# Altium schematic sheet ESP32.SchDoc
size A3; SheetNumber: 3; SheetTotal: 16
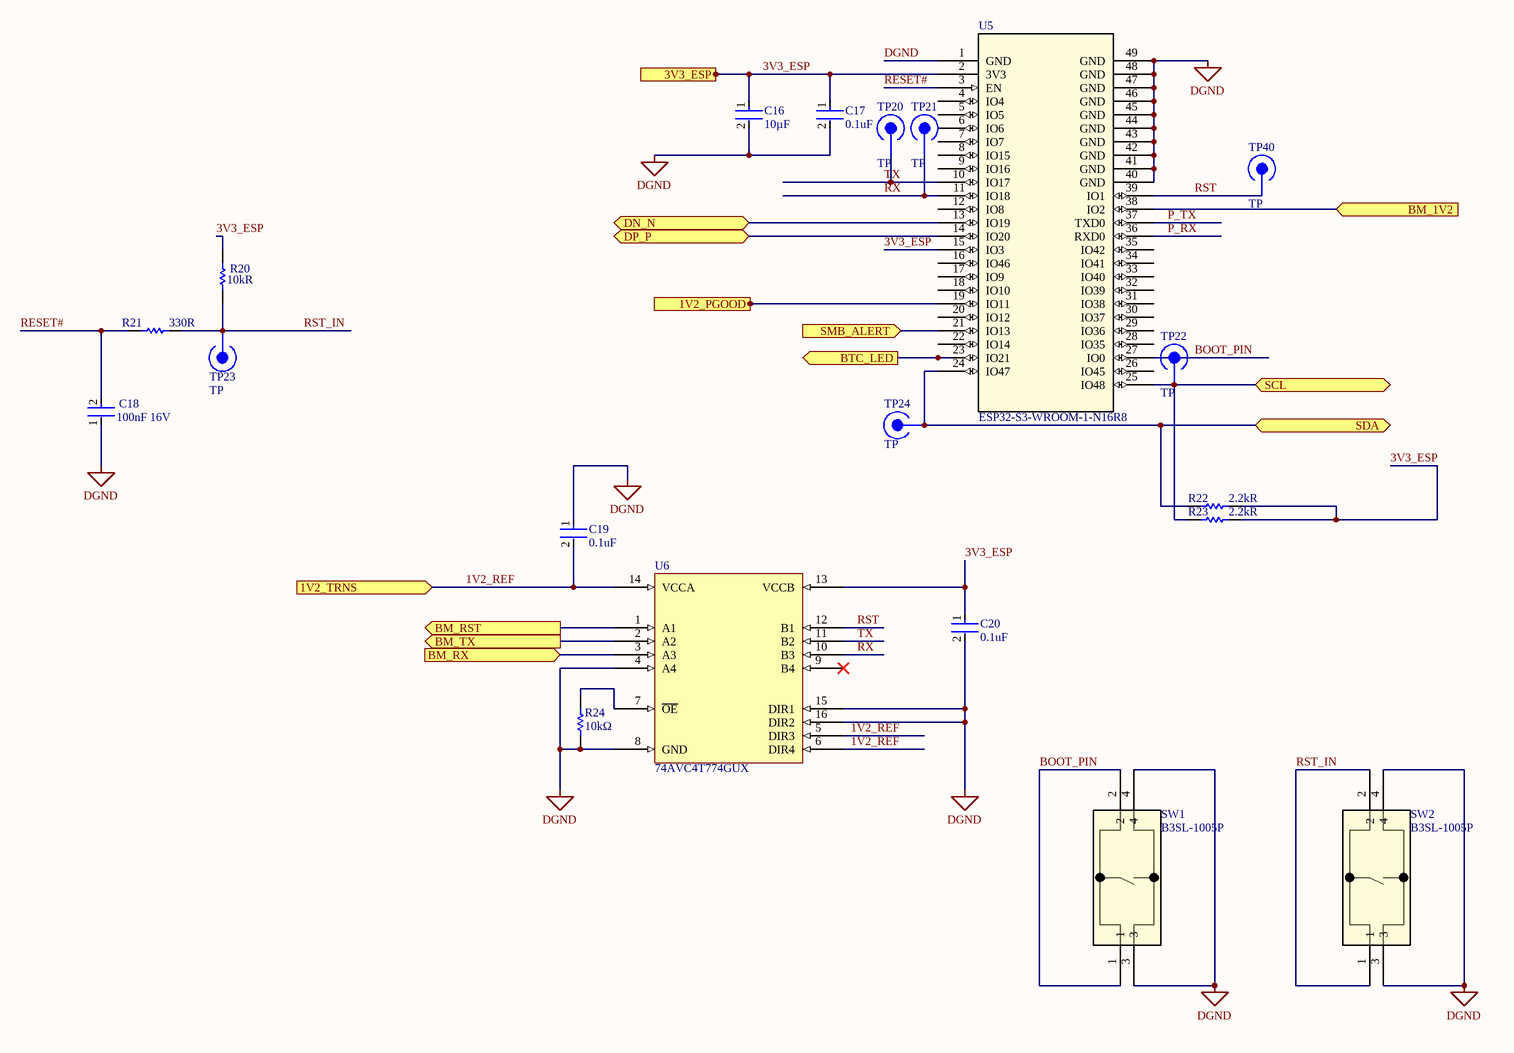
[diagram p0: ESP32.SchDoc]

## Parts
C16  value 10µF  [FP-GRM21B-0_15-MFG]  (hidden comment: GRM21BR61E106KA73L)
C17  value 0.1uF  [FP-CC0402-IPC_C]  (hidden comment: CC0402KRX7R7BB104)
C18  value 100nF  Rating: 16V  [FP-GRM15-MFG]  (hidden comment: GRM155R71C104KA88D)
C19  value 0.1uF  [FP-CC0402-IPC_C]  (hidden comment: CC0402KRX7R7BB104)
C20  value 0.1uF  [FP-CC0402-IPC_C]  (hidden comment: CC0402KRX7R7BB104)
R20  value 10kR  [RESC1005X40X25LL10T10]  (hidden comment: RK73H1ETTP1002F)
R21  value 330R  [RESC1005X40X25ML10T10]  (hidden comment: RK73H1ETTP3300F)
R22  value 2.2kR  [RESC1005X40X25NL10T10]  (hidden comment: RK73H1ETTP2201F)
R23  value 2.2kR  [RESC1005X40X25NL10T10]  (hidden comment: RK73H1ETTP2201F)
R24  value 10kΩ  [RESC1005X40X25LL10T10]  (hidden comment: RK73B1ETTP103J)
SW1  B3SL-1005P  [SW_B3SL-1002P_OMR]
SW2  B3SL-1005P  [SW_B3SL-1002P_OMR]
TP20  TP  [TP-Footprint-1]
TP21  TP  [TP-Footprint-1]
TP22  TP  [TP-Footprint-1]
TP23  TP  [TP-Footprint-1]
TP24  TP  [TP-Footprint-1]
TP40  TP  [TP-Footprint-1]
U5  ESP32-S3-WROOM-1-N16R8  [ESP32-S3-WROOM-1-N16R8-Footprint-1]
U6  74AVC4T774GUX  [74AVC4T774GUX-Footprint-1]

## Ports
1V2_PGOOD (in), 1V2_TRNS (in), 3V3_ESP (in), BM_1V2 (in), BM_RST (out), BM_RX (in), BM_TX (out), BTC_LED (out), DN_N (bidir), DP_P (bidir), SCL (bidir), SDA (bidir), SMB_ALERT (in)

## Nets
DGND: C16.2 C17.2 C18.1 C19.1 C20.2 R24.2 SW1.3 SW1.4 SW2.3 SW2.4 U5.1(GND) U5.40(GND) U5.41(GND) U5.42(GND) U5.43(GND) U5.44(GND) U5.45(GND) U5.46(GND) U5.47(GND) U5.48(GND) U5.49(GND) U6.4(A4) U6.8(GND) U6.15(DIR1) U6.16(DIR2)
1V2_PGOOD: U5.19(IO11) ; port 1V2_PGOOD
1V2_REF: C19.2 U6.5(DIR3) U6.6(DIR4) U6.14(VCCA) ; port 1V2_TRNS
3V3_ESP: C16.1 C17.1 C20.1 R20.2 R22.2 R23.2 U5.2(3V3) U5.15(IO3) U6.13(VCCB) ; port 3V3_ESP
BM_1V2: U5.38(IO2) ; port BM_1V2
BM_RST: U6.1(A1) ; port BM_RST
BM_RX: U6.3(A3) ; port BM_RX
BM_TX: U6.2(A2) ; port BM_TX
BOOT_PIN: SW1.1 SW1.2 U5.27(IO0)
BTC_LED: U5.23(IO21) ; port BTC_LED
DN_N: U5.13(IO19) ; port DN_N
DP_P: U5.14(IO20) ; port DP_P
P_RX: U5.36(RXD0)
P_TX: U5.37(TXD0)
RESET#: C18.2 R21.1 U5.3(EN)
RST: TP40.1 U5.39(IO1) U6.12(B1)
RST_IN: R20.1 R21.2 SW2.1 SW2.2 TP23.1
RX: TP21.1 U5.11(IO18) U6.10(B3)
SCL: R23.1 TP22.1 U5.25(IO48) ; port SCL
SDA: R22.1 TP24.1 U5.24(IO47) ; port SDA
SMB_ALERT: U5.21(IO13) ; port SMB_ALERT
TX: TP20.1 U5.10(IO17) U6.11(B2)
NetR24_1: R24.1 U6.7(~{OE})

Not connected (* = marked no-connect by the designer): U5 4(IO4) 5(IO5) 6(IO6) 7(IO7) 8(IO15) 9(IO16) 12(IO8) 16(IO46) 17(IO9) 18(IO10) 20(IO12) 22(IO14) 26(IO45) 28(IO35) 29(IO36) 30(IO37) 31(IO38) 32(IO39) 33(IO40) 34(IO41) 35(IO42); U6 9(B4)*

## Library data of the parts
C16 = CMP-001-00145-3: Ceramic Capacitor, Multilayer, Ceramic, 25V, 10% +Tol, 10% -Tol, X5R, 15% TC, 10uF, Surface Mount, 0805; Manufacturer: Murata; Reel Size: 8mm; Vendor: TTI; Template: MR_0805; Category: Capacitor; Price: 0.067; MOQ: 3000; Rating: 25V; Mounting: SMT; Package: 0805
C17 C19 C20 = CMP-001-00094-1: Multilayer Ceramic Capacitor, 0.1 uF, 25 V, ± 10%, X7R, 0402 [1005 Metric]; Rating: 16V; Reel Size: 8mm; Vendor: TTI; Category: Capacitor; Price: 0.004; Package: 0402; MOQ: 10000
C18 = CMP-001-00203-2: Ceramic Capacitor, Multilayer, Ceramic, 16V, 10% +Tol, 10% -Tol, X7R, 15% TC, 0.1uF, Surface Mount, 0402; Manufacturer: Murata; Reel Size: 8mm; Vendor: TTI; Template: MR_0402; Price Floor: 0.00317; MOQ: 10000; Price Floor Quantity: 750000; Category: Capacitor; Price @ MOQ: 0.003; Mounting: SMT; Case/Package: 0402; Design Item ID: CMP-00123-1; Source: Components - 07.02.25 - 13.24.SchLib
R20 = CMP-x00150-1: Fixed Resistor, Metal Glaze/thick Film, 0.1W, 10000ohm, 75V, 1% +/-Tol, 100ppm/Cel, Surface Mount, 0402
R21 = CMP-2002-04371-1: Manufacturer: KOA Speer; Part Number: RK73H1ETTP3300F
R22 R23 = CMP-2002-03812-1: Manufacturer: KOA Speer; Part Number: RK73H1ETTP2201F
R24 = CMP-009-00227-1: Fixed Resistor, Metal Glaze/thick Film, 0.1W, 10000ohm, 75V, 5% +/-Tol, 200ppm/Cel, Surface Mount, 0402; Rating: 1/10W; Vendor: TTI; Package: 0402; Price: 0.0017; Category: Resistor
SW1 SW2 = CMP-011-00029-1: No Description Available; Mfr_Name: Omron; Pins: 4; Design Item ID: B3SL-1005P; Component Type: Standard; Type: Type; RefDes: RefDes; Source: B3SL-1005P.SchLib
TP20-TP24 TP40 = CMP-001-0086-3: digital shovel test point
U5 = CMP-226-000000-01-A-2: No Description Available; Mfr_Name: Espressif Systems; Type: Type; Component Type: Standard; Design Item ID: ESP32-S3-WROOM-1-N16R8; Pin Count: 49; RefDes: RefDes; Source: ESP32-S3-WROOM-1-N16R8.SchLib
U6 = CMP-x00133-2: 74AVC4T774 - 4-bit dual supply translating transceiver; 3-state; Manufacturer: Nexperia; Template: NX_XQFN_16; Reel Width: 8mm; Vendor: TTI; MOQ: 4000; Mounting: SMT; Price: 0.301; Package: XQFN_16; Category: Integrated Circuit